# Altium schematic sheet LCL_TempSensor.SchDoc
size A4; Organization: Altium Limited; Address1: L3, 12a Rodborough Rd; Address2: Frenchs Forest; Address3: NSW; Address4: Australia 2086; DocumentNumber: 7; SheetNumber: 7; SheetTotal: 12
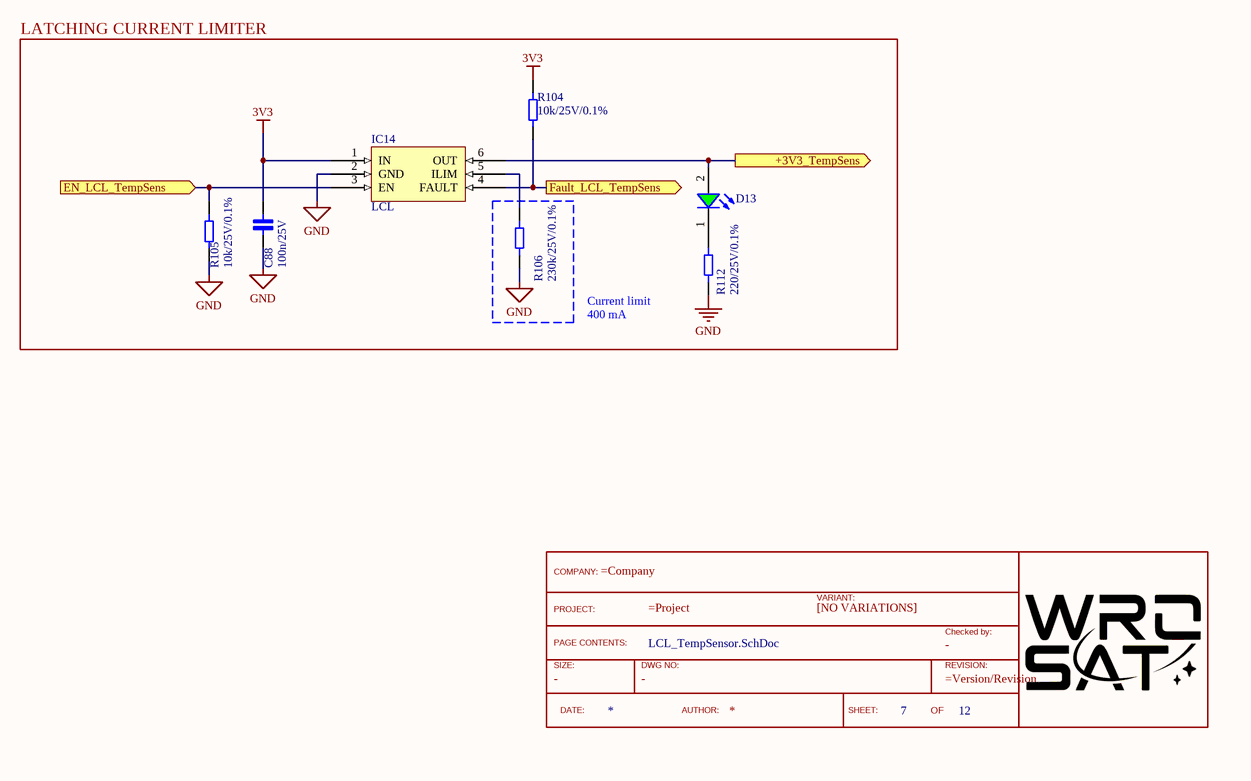
[diagram p0: LCL_TempSensor.SchDoc]

## Parts
?  TitleBlock  (value not drawn)  (graphical)
C88  100n/25V  [Cap_0402]
D13  Green, 3.2V  [WL-SMCW_0603_H=0.7mm]  (value not drawn)
IC14  LCL  [SOT-23-6]
R104  10k/25V/0.1%  [RES_0402]
R105  10k/25V/0.1%  [RES_0402]
R106  230k/25V/0.1%  [RES_0402]
R112  220/25V/0.1%  [RES_0402]

## Blocks framed on the sheet
LATCHING CURRENT LIMITER: C88 D13 IC14 R104-R106 R112

## Ports
+3V3_TempSens (out), EN_LCL_TempSens (in), Fault_LCL_TempSens (out)

## Nets
3V3: C88.2 IC14.1(IN) R104.2
GND: C88.1 IC14.2(GND) R105.1 R106.1 R112.1
+3V3_TempSens: D13.2(A) IC14.6(OUT) ; port +3V3_TempSens
EN_LCL_TempSens: IC14.3(EN) R105.2 ; port EN_LCL_TempSens
Fault_LCL_TempSens: IC14.4(FAULT) R104.1 ; port Fault_LCL_TempSens
NetD13_1: D13.1(K) R112.2
NetIC14_5: IC14.5(ILIM) R106.2

## Notes on the sheet
- (near R112) Current limit
- 400 mA
- Title
- Size:
- Date:
- A3
- Number:
- Time:
- Revision:
- Sheet
- of
- File:
- (in symbol TitleBlock) COMPANY:; VARIANT:; PROJECT:; [NO VARIATIONS]; Checked by:; PAGE CONTENTS:; SIZE:; DWG NO:; REVISION:; DATE:; AUTHOR:; SHEET:; OF

## Library data of the parts
? = TitleBlock: Standard TitleBlock; DrawingNo: -; Size: -; Checked: -
C88 = Cap_0402_100n: Ceramic Capacitor 100n / 0402 / 25V / ±5%, Wurth Elektronik MLCC; ComponentLink1Description: New link; ComponentLink1URL: https://www.we-online.com/catalog/en/WCAP-CSGP-25VDC
D13 = 150060GS75000: WL-SMCW SMT Mono-color Chip LED Waterclear, size 0603, Green, 3.2V, 140deg; Chip Technology: InGaN; Dominant Wavelength typ.: 525nm; Luminous Intensity typ.: 430mcd; Peak Wavelength typ.: 515nm; Viewing Angle: 140deg; ComponentLink1Description: Manufacturer; ComponentLink1URL: http://www.we-online.de; ComponentLink2URL: https://www.we-online.com/catalog/datasheet/150060GS75000.pdf; ComponentLink2Description: Datasheet; Forward Voltage typ.: 3.2V; Emitting Color: Green; Mounting Technology: SMT; Operating Temperature: -40 to +85degC; Published Date: December 2019; Part Number: 150060GS75000; Packaging: Tape and Reel; Size: 0603; Publisher: Wurth Elektronik
IC14 = TPS2553: Latch-off Current Limiter; ComponentLink1Description: New link; ComponentLink1URL: https://www.ti.com/lit/ds/symlink/tps2553.pdf?ts=1603819295065&ref_url=https%253A%252F%252Fwww.google.com%252F
R104 R105 = Res_0402_10k: Vishay, thin film resistor 10k/25V/0.1%
R106 = Res_0402_230k: Vishay, thin film resistor 230k/25V/0.1%
R112 = Res_0402_1: Vishay, thin film resistor 1/25V/0.1%